# EAGLE design TDA7419  (EAGLE 7.5.0)
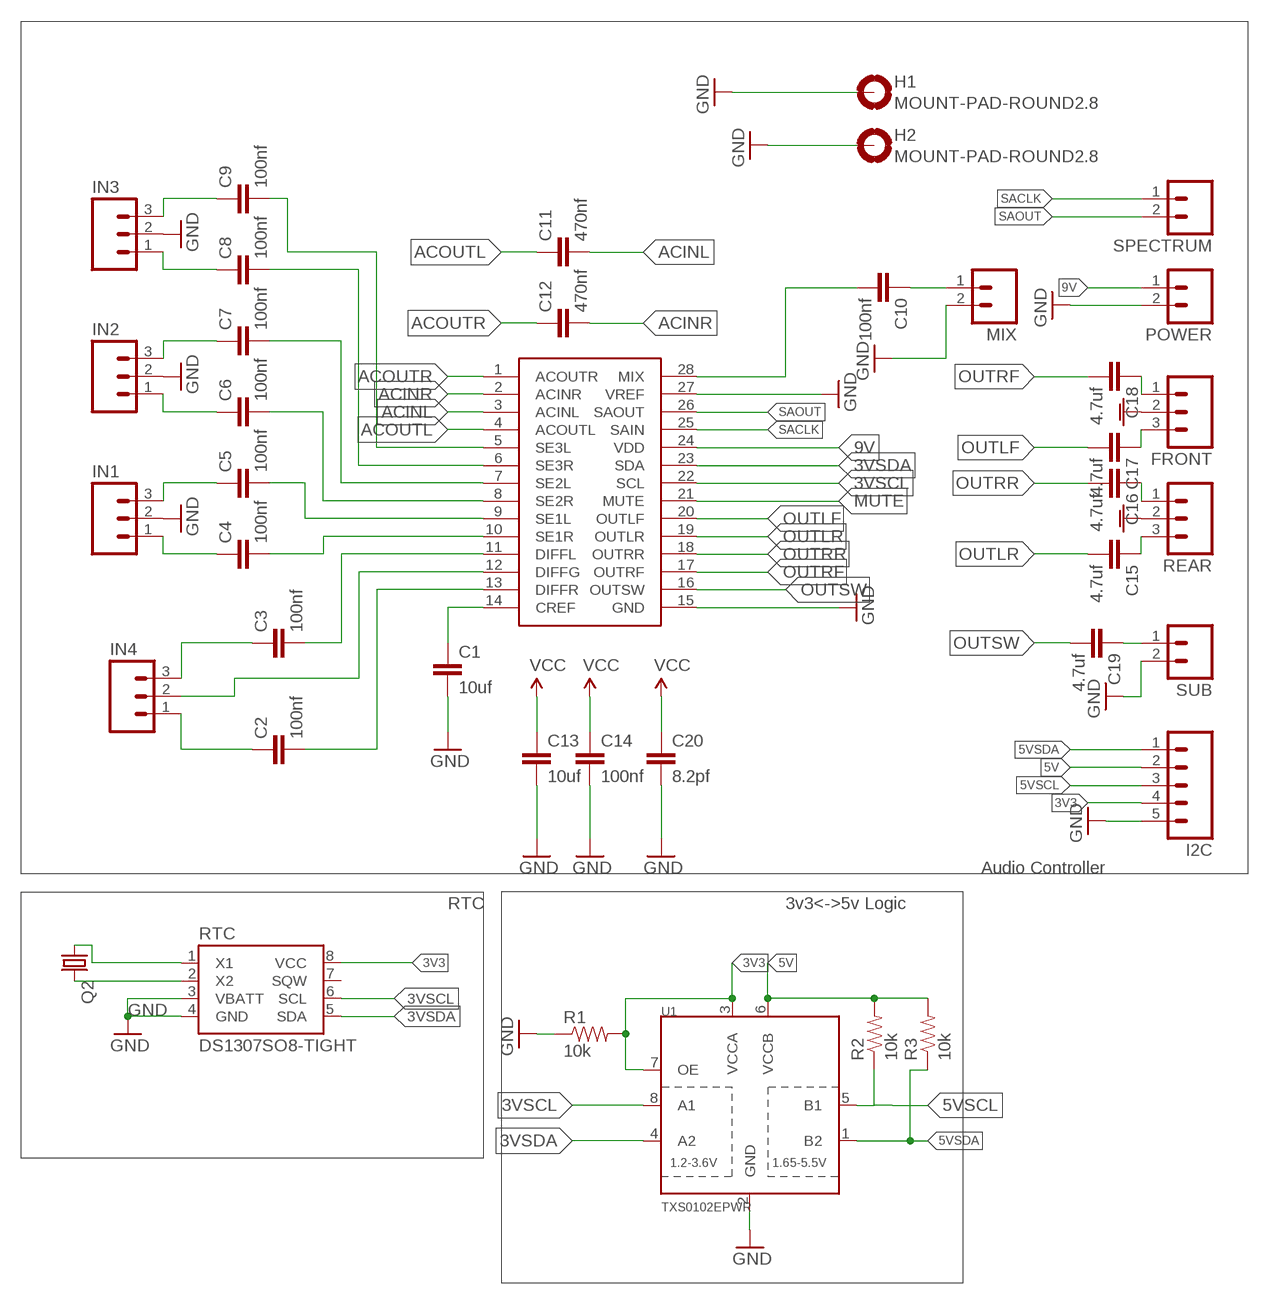
[diagram p0: schematic, sheet 1]

## Parts
C1  10uf  0603CAP  [0603-CAP]
C2  100nf  0603CAP  [0603-CAP]
C3  100nf  0603CAP  [0603-CAP]
C4  100nf  0603CAP  [0603-CAP]
C5  100nf  0603CAP  [0603-CAP]
C6  100nf  0603CAP  [0603-CAP]
C7  100nf  0603CAP  [0603-CAP]
C8  100nf  0603CAP  [0603-CAP]
C9  100nf  0603CAP  [0603-CAP]
C10  100nf  0603CAP  [0603-CAP]
C11  470nf  0603CAP  [0603-CAP]
C12  470nf  0603CAP  [0603-CAP]
C13  10uf  0603CAP  [0603-CAP]
C14  100nf  0603CAP  [0603-CAP]
C15  4.7uf  0603CAP  [0603-CAP]
C16  4.7uf  0603CAP  [0603-CAP]
C17  4.7uf  0603CAP  [0603-CAP]
C18  4.7uf  0603CAP  [0603-CAP]
C19  4.7uf  0603CAP  [0603-CAP]
C20  8.2pf  0603CAP  [0603-CAP]
FRONT  M03PTH  [1X03]
H1  MOUNT-PAD-ROUND2.8  [2,8-PAD]
H2  MOUNT-PAD-ROUND2.8  [2,8-PAD]
I2C  M05  [05P]
IN1  M03  [03P]
IN2  M03  [03P]
IN3  M03  [03P]
IN4  M03  [03P]
MIX  M02  [02P]
POWER  M02  [02P]
Q2  CRYSTALTC26H_EZ  [TC26HEZ]
R1  10k  RESISTOR0603  [0603-RES]
R2  10k  RESISTOR0603  [0603-RES]
R3  10k  RESISTOR0603  [0603-RES]
REAR  M03PTH  [1X03]
RTC  DS1307SO8-TIGHT  [SO08-TIGHT]
SPECTRUM  M02  [02P]
SUB  M02  [02P]
TDA  TDA7419  [SOIC-28]
U1  TXS0102EPWR  [TSSOP8]

## Nets
3V3: I2C.4 R1.2 RTC.8(VCC) U1.3(VCCA) U1.7(OE)
3VSCL: RTC.6(SCL) TDA.22(SCL) U1.8(A1)
3VSDA: RTC.5(SDA) TDA.23(SDA) U1.4(A2)
5V: I2C.2 R2.2 R3.2 U1.6(VCCB)
5VSCL: I2C.3 R2.1 U1.5(B1)
5VSDA: I2C.1 R3.1 U1.1(B2)
9V: C13.1 C14.1 C20.1 POWER.1 TDA.24(VDD) ; supply symbol labelled VCC
ACINL: C11.2 TDA.3(ACINL)
ACINR: C12.2 TDA.2(ACINR)
ACOUTL: C11.1 TDA.4(ACOUTL)
ACOUTR: C12.1 TDA.1(ACOUTR)
CREF: C1.1 TDA.14(CREF)
DIFFG: IN4.2 TDA.12(DIFFG)
DIFFL: C3.2 TDA.11(DIFFL)
DIFFR: C2.2 TDA.13(DIFFR)
GND: C1.2 C13.2 C14.2 C20.2 FRONT.2 H1.B2,8(MOUNT) H2.B2,8(MOUNT) I2C.5 IN1.2 IN2.2 IN3.2 MIX.2 POWER.2 R1.1 REAR.2 RTC.3(VBATT) RTC.4(GND) SUB.2 TDA.15(GND) TDA.27(VREF) U1.2(GND) ; supply symbol labelled AGND
MIX: C10.2 TDA.28(MIX)
MUTE: TDA.21(MUTE)
N$1: C10.1 MIX.1
N$4: C9.1 IN3.3
N$5: C8.1 IN3.1
N$6: C7.1 IN2.3
N$7: C6.1 IN2.1
N$8: C5.1 IN1.3
N$9: C4.1 IN1.1
N$10: C3.1 IN4.3
N$11: C2.1 IN4.1
N$17: C18.1 FRONT.1
N$18: C17.1 FRONT.3
N$19: C16.1 REAR.1
N$20: C15.1 REAR.3
N$21: C19.1 SUB.1
N$25: Q2.2 RTC.2(X2)
N$30: Q2.1 RTC.1(X1)
OUTLF: C17.2 TDA.20(OUTLF)
OUTLR: C15.2 TDA.19(OUTLR)
OUTRF: C18.2 TDA.17(OUTRF)
OUTRR: C16.2 TDA.18(OUTRR)
OUTSW: C19.2 TDA.16(OUTSW)
SACLK: SPECTRUM.1 TDA.25(SAIN)
SAOUT: SPECTRUM.2 TDA.26(SAOUT)
SE1L: C5.2 TDA.9(SE1L)
SE1R: C4.2 TDA.10(SE1R)
SE2L: C7.2 TDA.7(SE2L)
SE2R: C6.2 TDA.8(SE2R)
SE3L: C9.2 TDA.5(SE3L)
SE3R: C8.2 TDA.6(SE3R)
Unconnected: RTC.7(SQW)

## Notes on the sheet
- Audio Controller
- RTC | 3v3<->5v Logic

## Library data of the parts
C1-C20 = john:0603CAP
FRONT REAR = SparkFun-Connectors:M03: Header 3 Standard 3-pin 0.1" header. Use with straight break away headers (SKU : PRT-00116), right angle break away headers (PRT-00553), swiss pins (PRT-00743), machine pins (PRT-00117), and female headers (PRT-00115). Molex polarized connector foot print use with SKU : PRT-08232 with associated crimp pins and housings.
H1 H2 = holes:MOUNT-PAD-ROUND: MOUNTING PAD, round
I2C = con-amp-quick:M05: AMP QUICK CONNECTOR; OC_FARNELL: unknown; OC_NEWARK: unknown
IN1-IN4 = con-amp-quick:M03: AMP QUICK CONNECTOR; OC_FARNELL: unknown; OC_NEWARK: unknown
MIX POWER SPECTRUM SUB = con-amp-quick:M02: AMP QUICK CONNECTOR; OC_FARNELL: unknown; OC_NEWARK: unknown
Q2 = SparkFun-FreqCtrl:CRYSTAL: Various standard crystals. Proven footprints.
R1-R3 = john:RESISTOR: Resistor Basic schematic elements and footprints for 0603, 1206, and PTH resistors.
RTC = SparkFun-FreqCtrl:DS1307: I2C real-time clock with battery backup.; PROD_ID: IC-08138
TDA = john:TDA7419
U1 = john:TXS0102EPWR

## Board
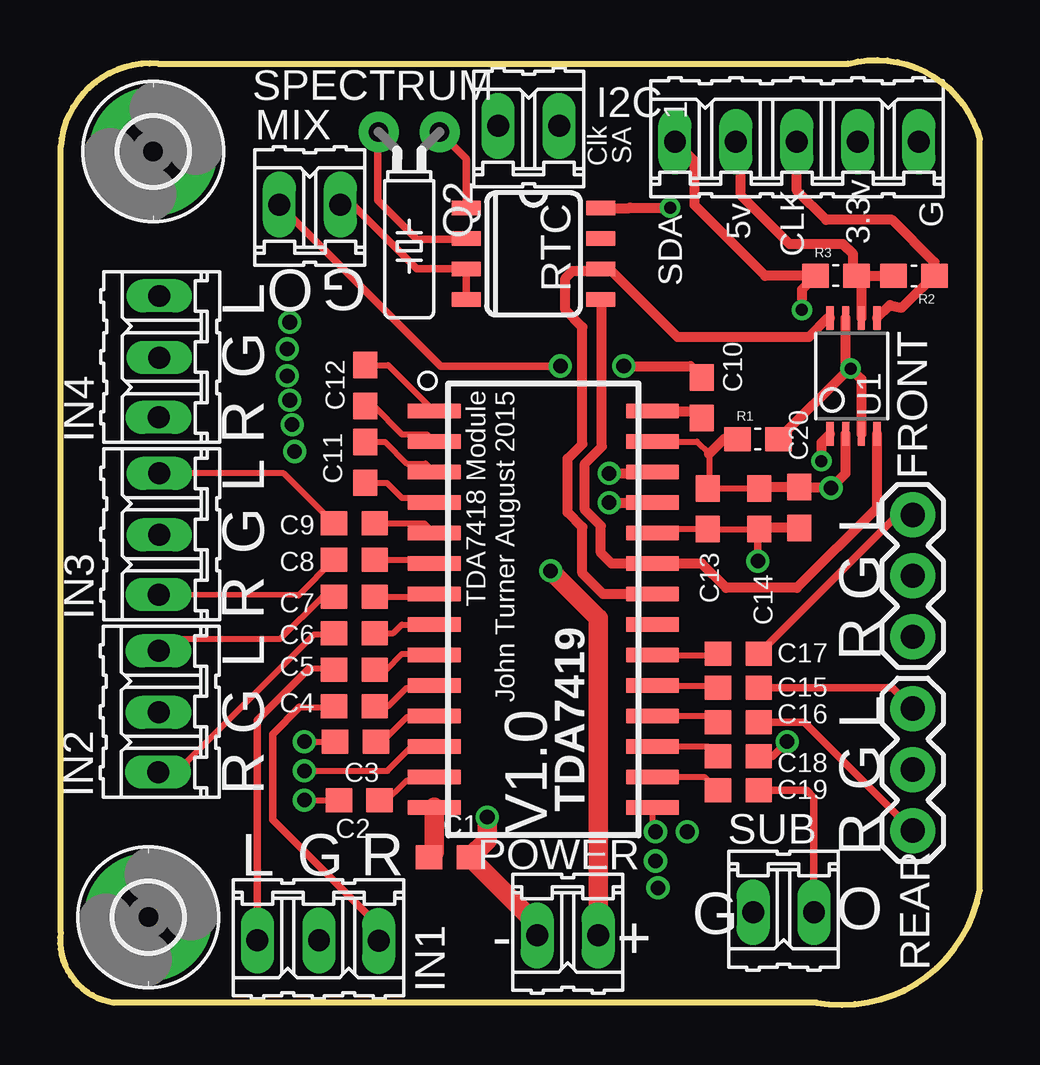
[diagram p1: board, top side]
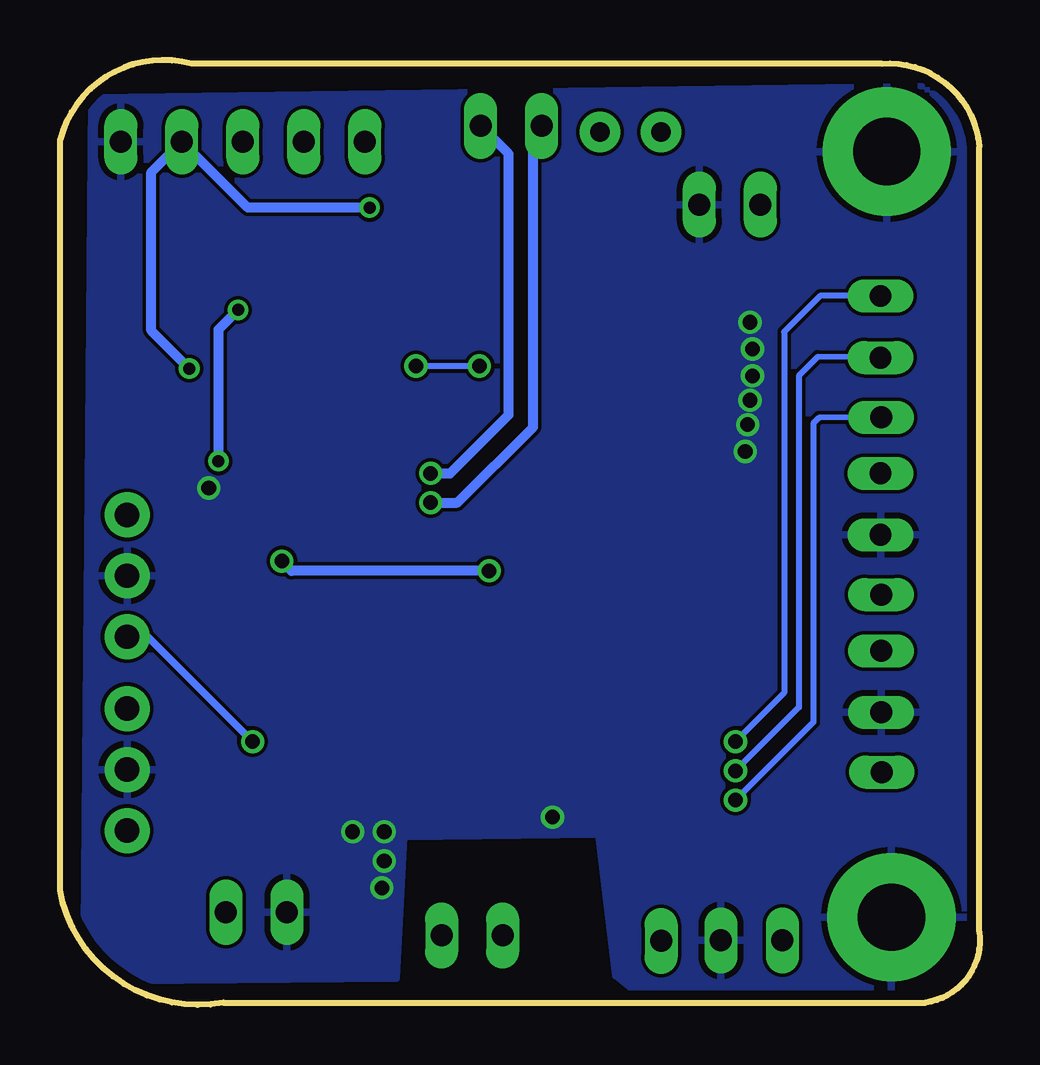
[diagram p2: board, bottom side, seen from below]

Size 38.32 x 39.37 mm. Coordinates in mm from the lower left corner, seen from the top.
Outline: 32.84,39.21 arc-90 38.33,36.06 38.33,4.77 arc-90 31.52,0.1 2.26,0.1 arc-90 0.02,3.04 0.02,35.76 arc-90 4.09,39.21 32.84,39.21
Copper layers (1*16): Top 0.0356mm / dielectric 1.5011mm / Bottom 0.0356mm
Design rules "LaenPCBOrder": minimum track width 6mil, minimum drill 13mil, track to track 6mil, track to pad 6mil, pad to pad 6mil, via to via 6mil, smd to smd 6mil, copper to edge 15mil, drill to drill 6mil, minimum pad ring 7mil, minimum via ring 7mil, stop-mask expansion 3mil, vias tented up to drill 0mil, thermal gap 10mil

### Footprints (pad centres in the part's own frame; a part is rotated, then mirrored left to right if it is on the bottom)
0603-CAP = smd 1.1 x 1: 1 -0.85,0; 2 0.85,0
1X03 = drill 1.016 pad 1.88: 1 0,0; 2 2.54,0; 3 5.08,0
2,8-PAD = drill 2.8 pad 5.334: B2,8 0,0
05P = drill 0.914 long: 1 -5.08,0; 2 -2.54,0; 3 0,0; 4 2.54,0; 5 5.08,0
03P = drill 0.914 long: 1 -2.515,0.254; 2 -0.025,0.229; 3 2.54,0.229
02P = drill 0.914 long: 1 -1.27,0.254; 2 1.27,0.254
TC26HEZ = drill 0.813 pad 1.676: 1 -1.27,0; 2 1.27,0
0603-RES = smd 1.1 x 1: 1 -0.85,0; 2 0.85,0
SO08-TIGHT = smd 0.6 x 1.2: 1 -1.905,-2.8; 2 -0.635,-2.8; 3 0.635,-2.8; 4 1.905,-2.8; 5 1.905,2.8; 6 0.635,2.8; 7 -0.635,2.8; 8 -1.905,2.8
SOIC-28 = smd 0.6 x 2.2: 1 8.89,4.548; 2 7.62,4.548; 3 6.35,4.548; 4 5.08,4.548; 5 3.81,4.548; 6 2.54,4.548; 7 1.27,4.548; 8 0,4.548; 9 -1.27,4.548; 10 -2.54,4.548; 11 -3.81,4.548; 12 -5.08,4.548; 13 -6.35,4.548; 14 -7.62,4.548; 15 -7.62,-4.548; 16 -6.35,-4.548; 17 -5.08,-4.548; 18 -3.81,-4.548; 19 -2.54,-4.548; 20 -1.27,-4.548; 21 0,-4.548; 22 1.27,-4.548; 23 2.54,-4.548; 24 3.81,-4.548; 25 5.08,-4.548; 26 6.35,-4.548; 27 7.62,-4.548; 28 8.89,-4.548
TSSOP8 = smd 0.305 x 0.991: 1 -0.65,-1.908; 2 0,-1.908; 3 0.65,-1.908; 4 1.3,-1.908; 5 1.3,2.918; 6 0.65,2.918; 7 0,2.918; 8 -0.65,2.918

### Placement (x,y rotation side)
C1  16.23,6.14 0 top
C2  12.47,8.53 0 top
C3  12.32,10.97 0 top
C4  12.26,12.44 0 top
C5  12.26,13.97 0 top
C6  12.26,15.49 0 top
C7  12.26,17.01 0 top
C8  12.26,18.54 0 top
C9  12.26,20.06 0 top
C10  26.74,25.3 270 top
C11  12.72,22.6 90 top
C12  12.72,25.8 270 top
C13  27,20.67 90 top
C14  29.13,20.67 90 top
C15  28.27,13.2 180 top
C16  28.27,11.78 180 top
C17  28.27,14.63 180 top
C18  28.27,10.36 180 top
C19  28.27,8.94 180 top
C20  30.81,20.72 90 top
FRONT  35.53,15.34 90 top
H1  3.68,3.65 0 top
H2  3.88,35.56 0 top
I2C  30.7,35.96 0 top
IN1  10.77,2.92 180 top
IN2  4.34,12.21 90 top
IN3  4.37,19.61 90 top
IN4  4.37,27 90 top
MIX  10.41,33.09 0 top
POWER  21.15,3.15 180 top
Q2  14.55,36.37 180 top
R1  29.08,23.57 0 top
R2  35.58,30.38 180 top
R3  32.33,30.38 0 top
REAR  35.53,7.26 90 top
RTC  19.73,31.29 270 top
SPECTRUM  19.53,36.37 0 top
SUB  30.15,4.11 180 top
TDA  20.14,15.85 90 top
U1  32.74,25.7 0 top

### Tracks (layer width: path | path; a pad name or v marks a point on that pad's centre or on a via)
3V3  (via drill 0.5)
  Top 0.406: RTC.8 23.72,33.19 23.75,33.22 v25.42,33.22 | v32.94,26.51 32.74,26.72 U1.7 | v32.94,26.51 33.39,26.07 U1.3 | R1.2 32.88,26.51 v32.94,26.51
  Bottom 0.406: v32.94,26.51 34.52,28.09 34.52,34.69 I2C.4 30.5,33.22 v25.42,33.22
3VSCL
  Top 0.406: TDA.22 22.63,17.12 21.76,17.98 21.76,19.91 21.15,20.52 21.15,22.76 21.76,23.36 21.76,28.24 21.05,28.95 21.05,30.27 21.36,30.58 22.46,30.58 RTC.6 22.91,30.65 25.73,27.84 31.21,27.84 32,28.62 U1.8 32.06,28.65
3VSDA
  Top 0.406: U1.4 34.04,20.7 30.71,17.37 27.76,17.37 26.74,18.39 TDA.23 22.98,18.39 22.53,18.84 22.53,19.96 21.87,20.62 21.87,22.55 22.58,23.26 22.58,29.34 RTC.5
5V
  Top 0.406: R3.2 R2.2 | R3.2 33.39,30.17 U1.6 | R3.2 33.04,30.51 33.04,31.29 32.64,31.7 30.4,31.7 28.37,33.73 28.37,35.76 I2C.2
5VSCL
  Top 0.406: U1.5 34.57,29.16 35.07,29.05 35.31,29.29 R2.1 36.43,30.95 34.67,32.71 31.92,32.71 30.71,33.93 I2C.3
5VSDA  (via drill 0.5)
  Top 0.406: v30.91,28.95 30.91,29.8 R3.1 29.38,30.38 26.44,33.32 26.44,35.15 I2C.1 | U1.1 31.72,23.43 v31.72,22.65
  Bottom 0.406: v30.91,28.95 31.72,28.14 v31.72,22.65
9V  (via drill 0.61)
  Top 0.254: TDA.24 24.85,19.82 C13.1 C14.1
  Top 0.305: v29.08,18.49 29.08,19.77 C14.1
  Top 0.406: C20.1 29.13,19.87 C14.1
  Top 0.813: POWER.1 22.42,16.1 v20.44,18.08
  Bottom 0.406: 28.88,18.28 v29.08,18.49 28.67,18.08 v20.44,18.08
ACINL
  Top 0.254: C11.2 13.55,23.45 14.45,22.55 15.24,22.55 TDA.3
ACINR
  Top 0.254: C12.2 13.06,24.95 14.25,23.77 15.29,23.77 TDA.2
ACOUTL
  Top 0.254: C11.1 13.62,21.75 14.25,21.13 15.39,21.13 TDA.4
ACOUTR
  Top 0.254: C12.1 13.67,26.65 TDA.1
CREF
  Top 0.813: C1.1 15.59,6.36 TDA.14
DIFFG  (via drill 0.61)
  Top 0.254: v10.18,9.75 13.64,9.75 14.65,10.77 TDA.12
  Bottom 0.254: IN4.2 6.75,27 7.54,26.21 7.54,12.39 v10.18,9.75
DIFFL
  Top 0.254: C3.2 13.43,10.97 14.45,11.99 15.54,11.99 TDA.11
DIFFR
  Top 0.254: C2.2 13.43,8.33 14.45,9.34 15.44,9.34 TDA.13
GND  (via drill 0.61)
  Top 0.254: C14.2 C13.2 27.05,21.57 27.05,22.96 26.54,23.47 TDA.27 | TDA.15 24.69,6.93 v24.81,7.21
  Top 0.305: MIX.2 12.19,33.35 14.86,30.68 16.91,30.68 RTC.3 RTC.4
  Top 0.406: R1.1 27.66,23.57 27.05,22.96 | U1.2 32.74,22.15 v32.13,21.54 32.13,21.57 C20.2 29.13,21.57 C14.2
  Top 0.813: POWER.2 19.88,3.34 C1.2 17.8,6.87 v17.8,7.82
  other vias: 26.13,7.21 24.91,4.87 24.81,5.99 9.78,23.06 9.67,24.18 9.57,25.19 9.47,26.21 9.47,27.33 9.57,28.44
  pour Bottom: 37,37.79 37.31,3.04 35.38,1.01 24.3,1.11 24,7.01 15.87,7.11 15.16,1.22 14.04,0.3 -0.18,0.61 0.33,38.3
MIX
  Top 0.406: TDA.28 26.45,24.74 C10.2
N$1  (via drill 0.61)
  Top 0.305: v20.85,26.62 15.87,26.62 MIX.1
  Top 0.406: 26.68,26.21 C10.1 26.27,26.62 v23.49,26.62
  Bottom 0.254: v20.85,26.62 v23.49,26.62
N$4
  Top 0.254: C9.1 9.33,22.15 IN3.3
N$5
  Top 0.254: C8.1 9.94,17.07 IN3.1
N$6
  Top 0.254: C7.1 10.94,17.01 9.17,15.24 4.82,15.24 IN2.3
N$7
  Top 0.254: 11.05,15.49 C6.1 11.36,15.44 10.59,15.44 5.31,10.16 5.31,9.75 4.42,9.75 IN2.1
N$8
  Top 0.254: 10.94,13.97 C5.1 11.36,14.02 10.39,14.02
  Top 0.305: IN1.3 8.23,11.86 10.39,14.02
N$9
  Top 0.254: 9.98,12.39 11.36,12.39 C4.1
  Top 0.305: IN1.1 13.28,3.3 8.86,7.72 8.86,11.27 9.98,12.39
N$10  (via drill 0.61)
  Top 0.254: v10.18,10.97 C3.1
  Bottom 0.254: IN4.3 6.65,29.54 8.15,28.04 8.15,13 v10.18,10.97
N$11  (via drill 0.61)
  Top 0.254: v10.18,8.53 C2.1
  Bottom 0.254: IN4.1 6.7,24.46 6.93,24.23 6.93,11.78 v10.18,8.53
N$17  (via drill 0.61)
  Top 0.305: C18.1 29.69,10.36 v30.3,10.97
  Bottom 0.305: v30.3,10.97 34.67,15.34 FRONT.1
N$18
  Top 0.305: C17.1 34.91,20.42 FRONT.3
N$19
  Top 0.305: REAR.1 31.01,11.78 C16.1
N$20
  Top 0.305: C15.1 34.67,13.2 REAR.3
N$21
  Top 0.305: C19.1 31.11,8.94 31.42,8.63 SUB.1
N$25
  Top 0.305: RTC.2 16.91,31.9 14.86,31.9 13.23,33.52 13.23,36.32 Q2.2
N$30
  Top 0.305: RTC.1 16.93,35.26 Q2.1
OUTLF
  Top 0.254: TDA.20 27.37,14.58 C17.2
OUTLR
  Top 0.254: TDA.19 27.32,13.31 C15.2
OUTRF
  Top 0.254: TDA.17 27.01,10.77 C18.2
OUTRR
  Top 0.254: TDA.18 27.16,12.04 C16.2
OUTSW
  Top 0.254: TDA.16 26.86,9.5 C19.2
SACLK  (via drill 0.6)
  Top 0.406: v22.88,20.93 TDA.25
  Bottom 0.406: v22.88,20.93 21.76,20.93 18.61,24.08 18.61,36.27 SPECTRUM.1
SAOUT  (via drill 0.6)
  Top 0.406: v22.88,22.15 24.64,22.15 TDA.26
  Bottom 0.406: v22.88,22.15 22.07,22.15 19.63,24.58 19.63,35.46 SPECTRUM.2
SE1L
  Top 0.254: C5.2 13.59,13.97 14.25,14.63 15.54,14.63 TDA.9
SE1R
  Top 0.254: C4.2 13.69,12.44 14.45,13.2 15.49,13.2 TDA.10
SE2L
  Top 0.254: C7.2 15.49,17.01 TDA.7
SE2R
  Top 0.254: C6.2 13.89,15.49 14.25,15.85 TDA.8
SE3L
  Top 0.254: C9.2 15.18,20.06 TDA.5
SE3R
  Top 0.254: C8.2 15.44,18.54 TDA.6

### Text on the board
tNames: SA | Clk | G | 5v | CLK | 3.3v | L | O | G | SDA | G | R | TDA7418 Module / John Turner August 2015 | L | L | G | G | G | R | R | L | G | V1.0 | L | R | G | R | L | G | R | - | O | G | +